# EAGLE design extension_v_1_0 (EAGLE 6.4)
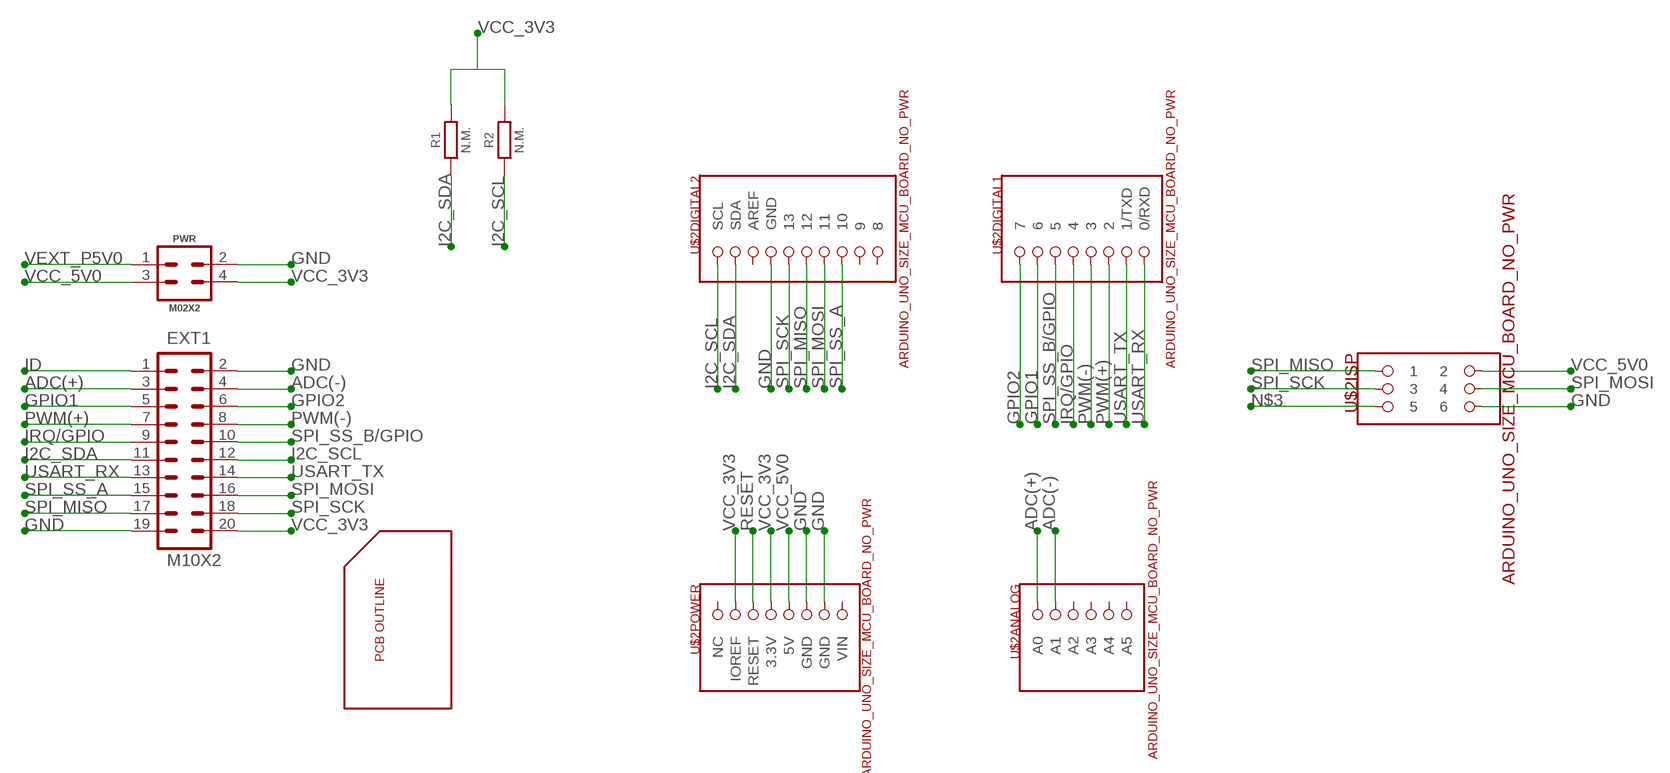
[diagram p0: schematic, sheet 1]

## Parts
EXT1  M10X2  [2X10]
PWR  M02X2  [H4X2_100_MIL]
R1  N.M.  R0603  [0603]
R2  N.M.  R0603  [0603]
U$2  ARDUINO_UNO_SIZE_MCU_BOARD_NO_PWR  [STANDARD_NO_PWR]

## Nets
ADC(+): EXT1.3 U$2.9(ANALOG:A0)
ADC(-): EXT1.4 U$2.11(ANALOG:A1)
GND: EXT1.2 EXT1.19 PWR.2 U$2.6(POWER:GND) U$2.7(POWER:GND) U$2.30(DIGITAL2:GND) U$2.ISCP6
GPIO1: EXT1.5 U$2.22
GPIO2: EXT1.6 U$2.23
I2C_SCL: EXT1.12 R2.1 U$2.50(DIGITAL2:SCL)
I2C_SDA: EXT1.11 R1.1 U$2.60(DIGITAL2:SDA)
ID: EXT1.1
IRQ/GPIO: EXT1.9 U$2.20
N$3: U$2.ISCP5
PWM(+): EXT1.7 U$2.18
PWM(-): EXT1.8 U$2.19
RESET: U$2.3(POWER:RESET)
SPI_MISO: EXT1.17 U$2.28 U$2.ICSP1
SPI_MOSI: EXT1.16 U$2.27 U$2.ISCP4
SPI_SCK: EXT1.18 U$2.29 U$2.ISCP3
SPI_SS_A: EXT1.15 U$2.26
SPI_SS_B/GPIO: EXT1.10 U$2.21
USART_RX: EXT1.13 U$2.16(DIGITAL1:0/RXD)
USART_TX: EXT1.14 U$2.17(DIGITAL1:1/TXD)
VCC_3V3: EXT1.20 PWR.4 R1.2 R2.2 U$2.2(POWER:IOREF) U$2.4(POWER:3.3V)
VCC_5V0: PWR.3 U$2.5(POWER:5V) U$2.ICSP2
VEXT_P5V0: PWR.1
Unconnected: U$2.1(POWER:NC) U$2.8(POWER:VIN) U$2.12(ANALOG:A2) U$2.13(ANALOG:A3) U$2.14(ANALOG:A4) U$2.15(ANALOG:A5) U$2.24 U$2.25 U$2.40(DIGITAL2:AREF)

## Library data of the parts
EXT1 = SparkFun:M10X2: This was SPECIALLY designed to be used with our Graphic LCD Backpack. Be sure you want to use this! It is not only staggered on each line of header holes, but IT IS ALSO offset of the center point of the top and bottom lines by 5 mil. This causes the headers to lock into place on the "standard" footprint on the LCD screen. The extra squares on the tdocu layer are there simply to reference other pins (if you were to actually populate a longer header than ten long - this is what we do with the backpacks).
PWR = ihpcb-pin_header:M02X2
R1 R2 = ihpcb-res_cap:R0603: Resistor 0603 imperial non-polar
U$2 = ihpcb-arduino:ARDUINO_UNO_SIZE_MCU_BOARD_NO_PWR

## Board
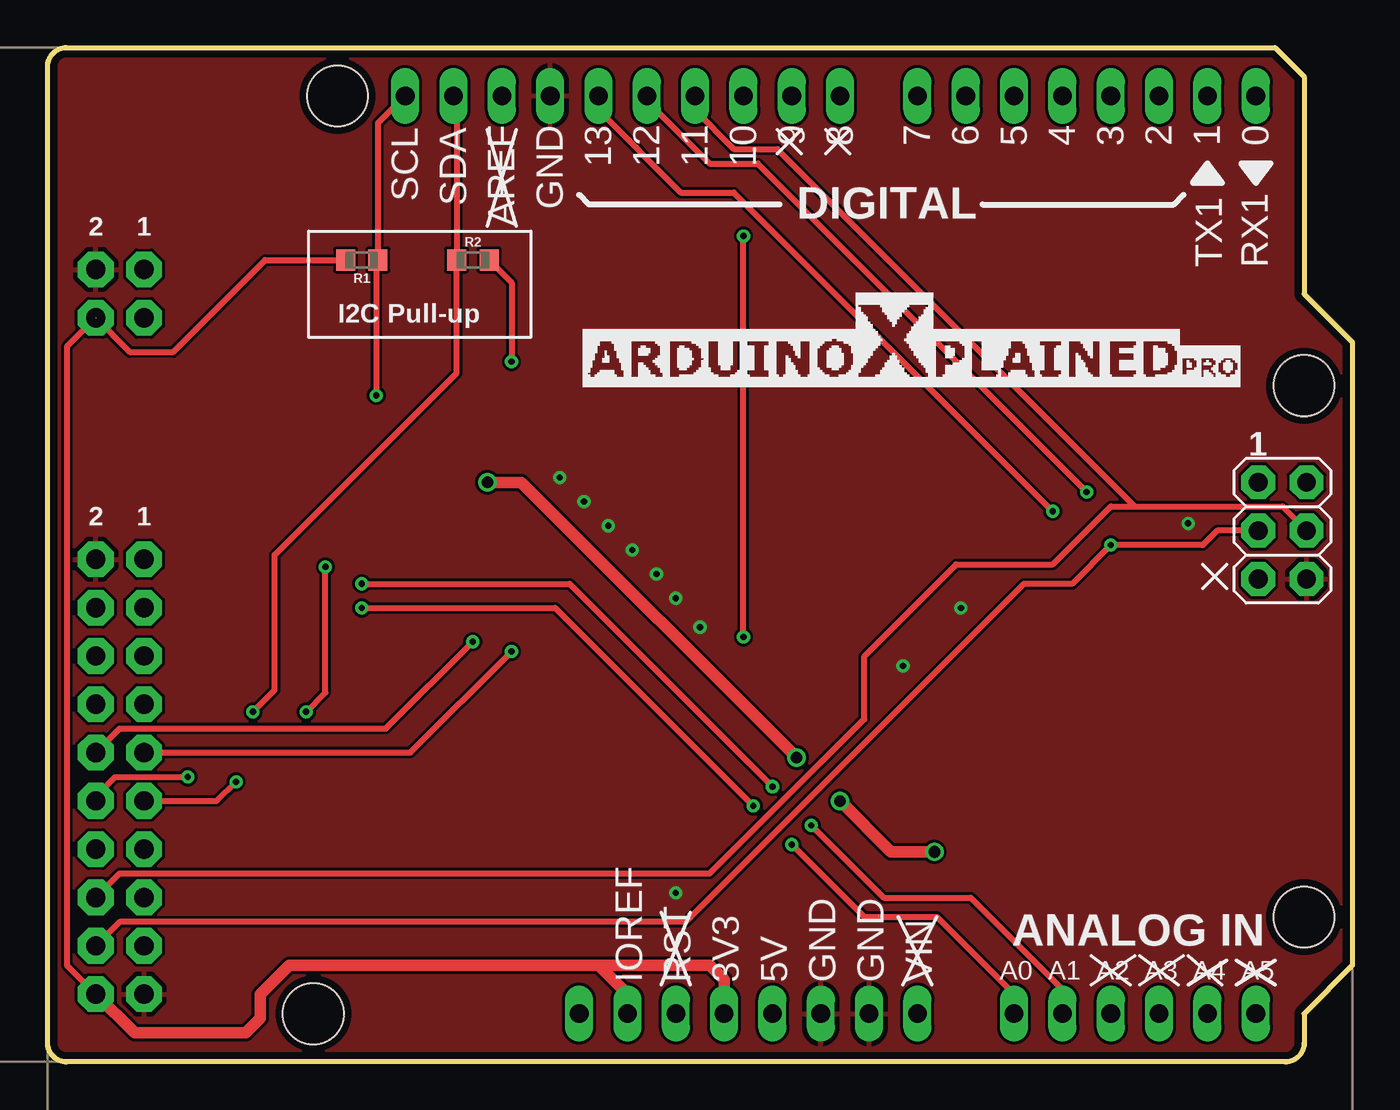
[diagram p1: board, top side]
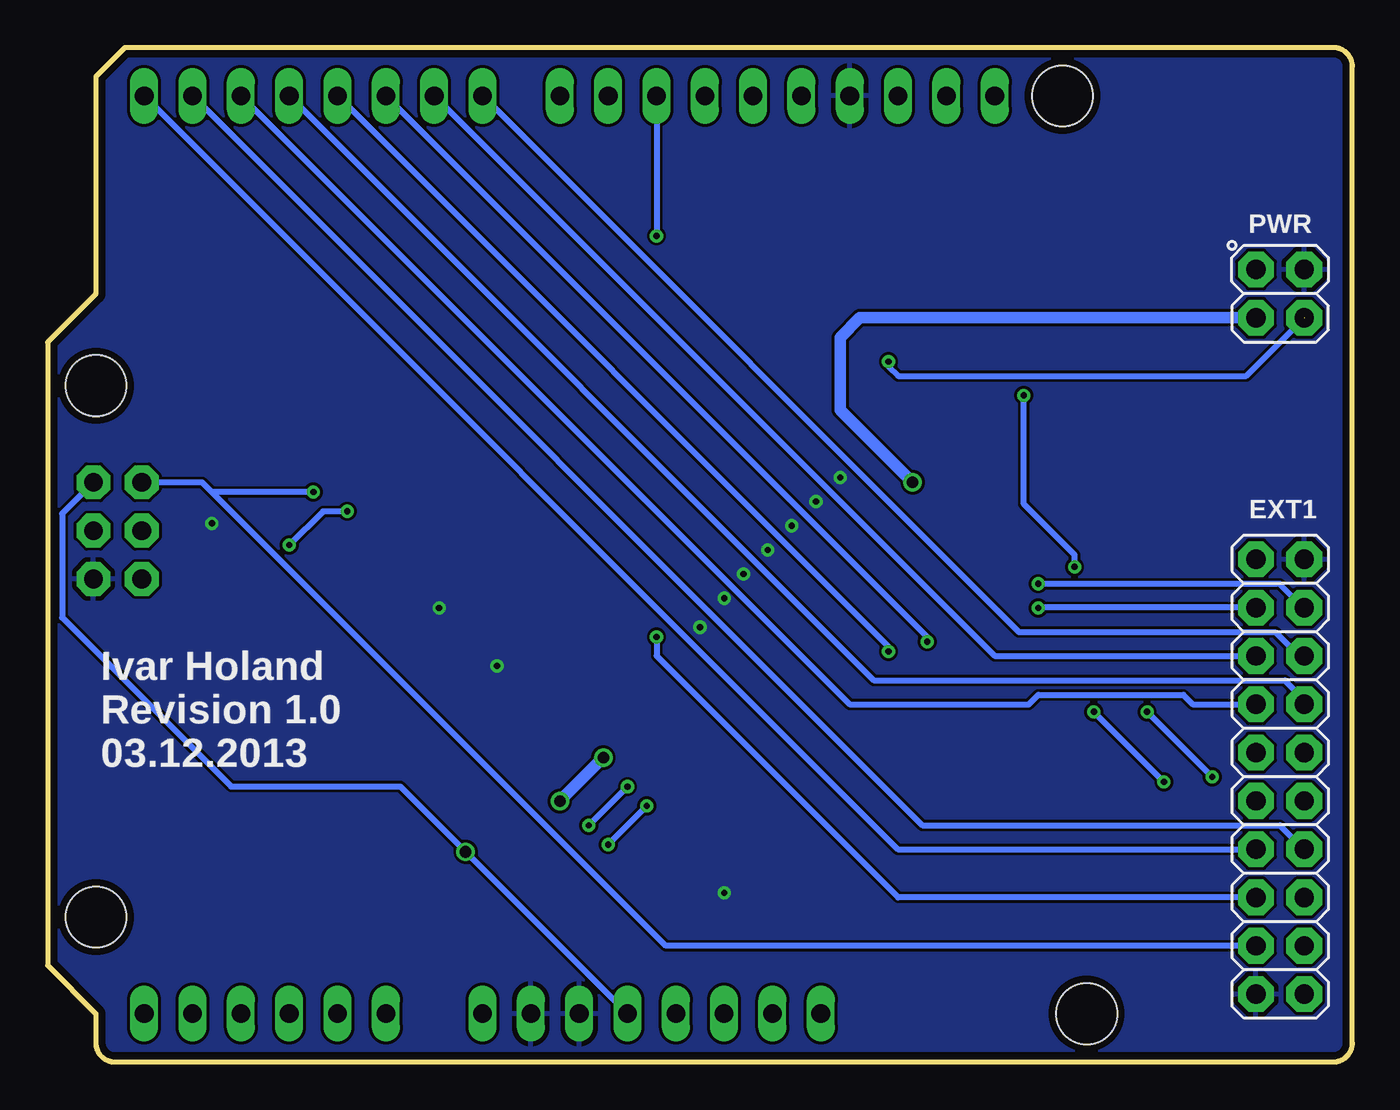
[diagram p2: board, bottom side, seen from below]

Size 68.58 x 53.34 mm. Coordinates in mm from the lower left corner, seen from the top.
Copper layers (1*16): Top 0.0356mm / dielectric 1.5011mm / Bottom 0.0356mm
Design rules "LaenPCBOrder": minimum track width 6mil, minimum drill 13mil, track to track 6mil, track to pad 6mil, pad to pad 6mil, via to via 6mil, smd to smd 6mil, copper to edge 15mil, drill to drill 6mil, minimum pad ring 7mil, minimum via ring 7mil, stop-mask expansion 3mil, vias tented up to drill 0mil, thermal gap 10mil

### Footprints (pad centres in the part's own frame; a part is rotated, then mirrored left to right if it is on the bottom)
2X10 = drill 1.016 pad 1.88 octagon: 1 -11.43,-1.27; 2 -11.43,1.27; 3 -8.89,-1.27; 4 -8.89,1.27; 5 -6.35,-1.27; 6 -6.35,1.27; 7 -3.81,-1.27; 8 -3.81,1.27; 9 -1.27,-1.27; 10 -1.27,1.27; 11 1.27,-1.27; 12 1.27,1.27; 13 3.81,-1.27; 14 3.81,1.27; 15 6.35,-1.27; 16 6.35,1.27; 17 8.89,-1.27; 18 8.89,1.27; 19 11.43,-1.27; 20 11.43,1.27
H4X2_100_MIL = drill 1.016 pad 1.88 octagon: 1 -1.27,1.27; 2 1.27,1.27; 3 -1.27,-1.27; 4 1.27,-1.27
0603 = smd 1 x 1.1: 1 -0.85,0; 2 0.85,0
STANDARD_NO_PWR = drill 0.98 long: 1 27.94,2.54; 2 30.48,2.54; 3 33.02,2.54; 4 35.56,2.54; 5 38.1,2.54; 6 40.64,2.54; 7 43.18,2.54; 8 45.72,2.54; 9 50.8,2.54; 11 53.34,2.54; 12 55.88,2.54; 13 58.42,2.54; 14 60.96,2.54; 15 63.5,2.54; 16 63.5,50.8; 17 60.96,50.8; 18 58.42,50.8; 19 55.88,50.8; 20 53.34,50.8; 21 50.8,50.8; 22 48.26,50.8; 23 45.72,50.8; 24 41.656,50.8; 25 39.116,50.8; 26 36.576,50.8; 27 34.036,50.8; 28 31.496,50.8; 29 28.956,50.8; 30 26.416,50.8; 40 23.876,50.8; 50 21.336,50.8; 60 18.796,50.8 | drill 0.98 pad 1.778 octagon: ICSP1 63.627,30.48; ICSP2 66.167,30.48; ISCP3 63.627,27.94; ISCP4 66.167,27.94; ISCP5 63.627,25.4; ISCP6 66.167,25.4 | hole 3.2: 13.97,2.54; 15.24,50.8; 66.04,35.56; 66.04,7.62

### Placement (x,y rotation side)
EXT1  3.8,15 270 bottom
PWR  3.8,40.4 0 bottom
R1  16.51,42.16 180 top
R2  22.35,42.16 0 top
U$1  [ARDUINOXPLAINEDPRO]  28.19,35.56 0 top
U$2  0,0 0 top

### Tracks (layer width: path | path; a pad name or v marks a point on that pad's centre or on a via)
ADC(+)  (via drill 0.33)
  Top 0.305: v16.51,23.88 26.67,23.88 v37.08,13.46 | v39.12,11.43 42.93,7.62 46.74,7.62 50.8,3.56 U$2.9
  Bottom 0.305: EXT1.3 16.5,23.89 v16.51,23.88 | v37.08,13.46 v39.12,11.43
ADC(-)  (via drill 0.33)
  Top 0.305: v16.51,25.15 27.43,25.15 v38.1,14.48 | v40.13,12.45 43.94,8.64 48.51,8.64 53.34,3.81 U$2.11
  Bottom 0.305: EXT1.4 2.55,23.89 3.81,25.15 v16.51,25.15 | v38.1,14.48 v40.13,12.45
GND  (via drill 0.33)
  other vias: 26.92,30.73 28.19,29.46 29.46,28.19 30.73,26.92 32,25.65 34.29,22.86 33.02,8.89 59.94,28.32 33.02,24.38 44.96,20.83 48.01,23.88
  pour Top: 0,0 68.58,0 68.58,53.34 0,53.34
  pour Bottom: 0,0 68.58,0 68.58,53.34 0,53.34
GPIO1
  Bottom 0.305: U$2.22 18.81,21.35 EXT1.5
GPIO2
  Bottom 0.305: U$2.23 17.53,22.61 4.06,22.61 2.81,21.35 EXT1.6
I2C_SCL  (via drill 0.33)
  Top 0.305: U$2.50 21.5,50.63 R2.1 21.5,36.23 11.94,26.67 11.94,19.56 v10.79,18.41 | EXT1.12 2.53,13.96 3.56,14.99 v7.37,14.99
  Bottom 0.305: v7.37,14.99 v10.79,18.41
I2C_SDA  (via drill 0.33)
  Top 0.305: U$2.60 17.36,49.36 R1.1 17.27,42.08 v17.27,35.05 | EXT1.11 8.9,13.73 v9.91,14.73 | v13.59,18.41 14.61,19.43 v14.61,26.04
  Bottom 0.305: v9.91,14.73 v13.59,18.41 | v14.61,26.04 14.61,26.67 17.27,29.34 v17.27,35.05
IRQ/GPIO  (via drill 0.33)
  Top 0.305: EXT1.9 19.06,16.27 v24.38,21.59
  Bottom 0.305: v24.38,21.59 24.38,21.84 U$2.20
PWM(+)
  Bottom 0.305: U$2.18 26.43,18.81 17.02,18.8 16.51,19.3 8.89,19.3 8.4,18.81 EXT1.7
PWM(-)
  Bottom 0.305: U$2.19 25.15,20.07 3.56,20.07 2.53,19.04 EXT1.8
SPI_MISO  (via drill 0.33)
  Top 0.305: U$2.28 31.5,50.55 34.8,47.24 37.34,47.24 v54.61,29.97
  Bottom 0.305: EXT1.17 36.08,6.11 59.94,29.97 | U$2.ICSP1 60.45,30.48 59.94,29.97 | v54.61,29.97 59.94,29.97
SPI_MOSI
  Top 0.305: EXT1.16 3.79,9.91 34.8,9.91 42.93,18.03 42.93,21.34 47.75,26.16 52.83,26.16 55.88,29.21 57.15,29.21 | 57.15,29.21 64.9,29.21 U$2.ISCP4 | U$2.27 34.04,50.04 36.07,48.01 38.35,48.01 57.15,29.21
SPI_SCK  (via drill 0.33)
  Top 0.305: EXT1.18 3.79,7.37 33.53,7.37 51.31,25.15 53.85,25.15 v55.88,27.18 60.71,27.18 61.47,27.94 U$2.ISCP3 | U$2.29 28.96,50.04 33.27,45.72 36.07,45.72 v52.83,28.96
  Bottom 0.305: v52.83,28.96 54.1,28.96 v55.88,27.18
SPI_SS_A  (via drill 0.33)
  Top 0.305: v36.58,22.35 v36.58,43.43
  Bottom 0.305: EXT1.15 23.88,8.65 36.58,21.35 v36.58,22.35 | U$2.26 v36.58,43.43
SPI_SS_B/GPIO  (via drill 0.33)
  Top 0.305: EXT1.10 3.79,17.53 17.78,17.53 v22.35,22.1
  Bottom 0.305: v22.35,22.1 22.35,22.35 U$2.21
USART_RX
  Bottom 0.305: U$2.16 23.89,11.19 EXT1.13
USART_TX
  Bottom 0.305: U$2.17 22.61,12.45 3.81,12.45 2.55,11.19 EXT1.14
VCC_3V3  (via drill 0.33)  (1 unrouted)
  Top 0.305: EXT1.20 1.02,5.08 1.02,37.62 PWR.4 4.32,37.34 6.6,37.34 11.43,42.16 R1.2 | R2.2 24.38,40.98 v24.38,36.83
  Top 0.61: EXT1.20 4.58,1.52 10.41,1.52 11.18,2.29 11.18,3.56 12.7,5.08 28.96,5.08 | 28.96,5.08 30.48,3.56 U$2.2 | U$2.4 35.56,4.32 34.8,5.08 28.96,5.08
  Bottom 0.305: v24.38,36.83 24.38,36.58 23.88,36.07 5.59,36.07 2.54,39.12
VCC_5V0  (via drill 0.61)
  Top 0.61: v23.11,30.48 24.89,30.48 v39.37,16 | v41.66,13.72 44.32,11.05 v46.61,11.05
  Bottom 0.305: U$2.ICSP2 67.82,28.83 67.82,23.37 58.93,14.48 50.04,14.48 v46.61,11.05 U$2.5
  Bottom 0.61: PWR.3 25.89,39.13 26.92,38.1 26.92,34.29 v23.11,30.48 | v39.37,16 v41.66,13.72

### Text on the board
tPlace: 2 | 1 | I2C Pull-up | 2 | 1
bPlace: Ivar Holand / Revision 1.0 / 03.12.2013